# Altium schematic sheet 07_EL_CON.SchDoc
size A2
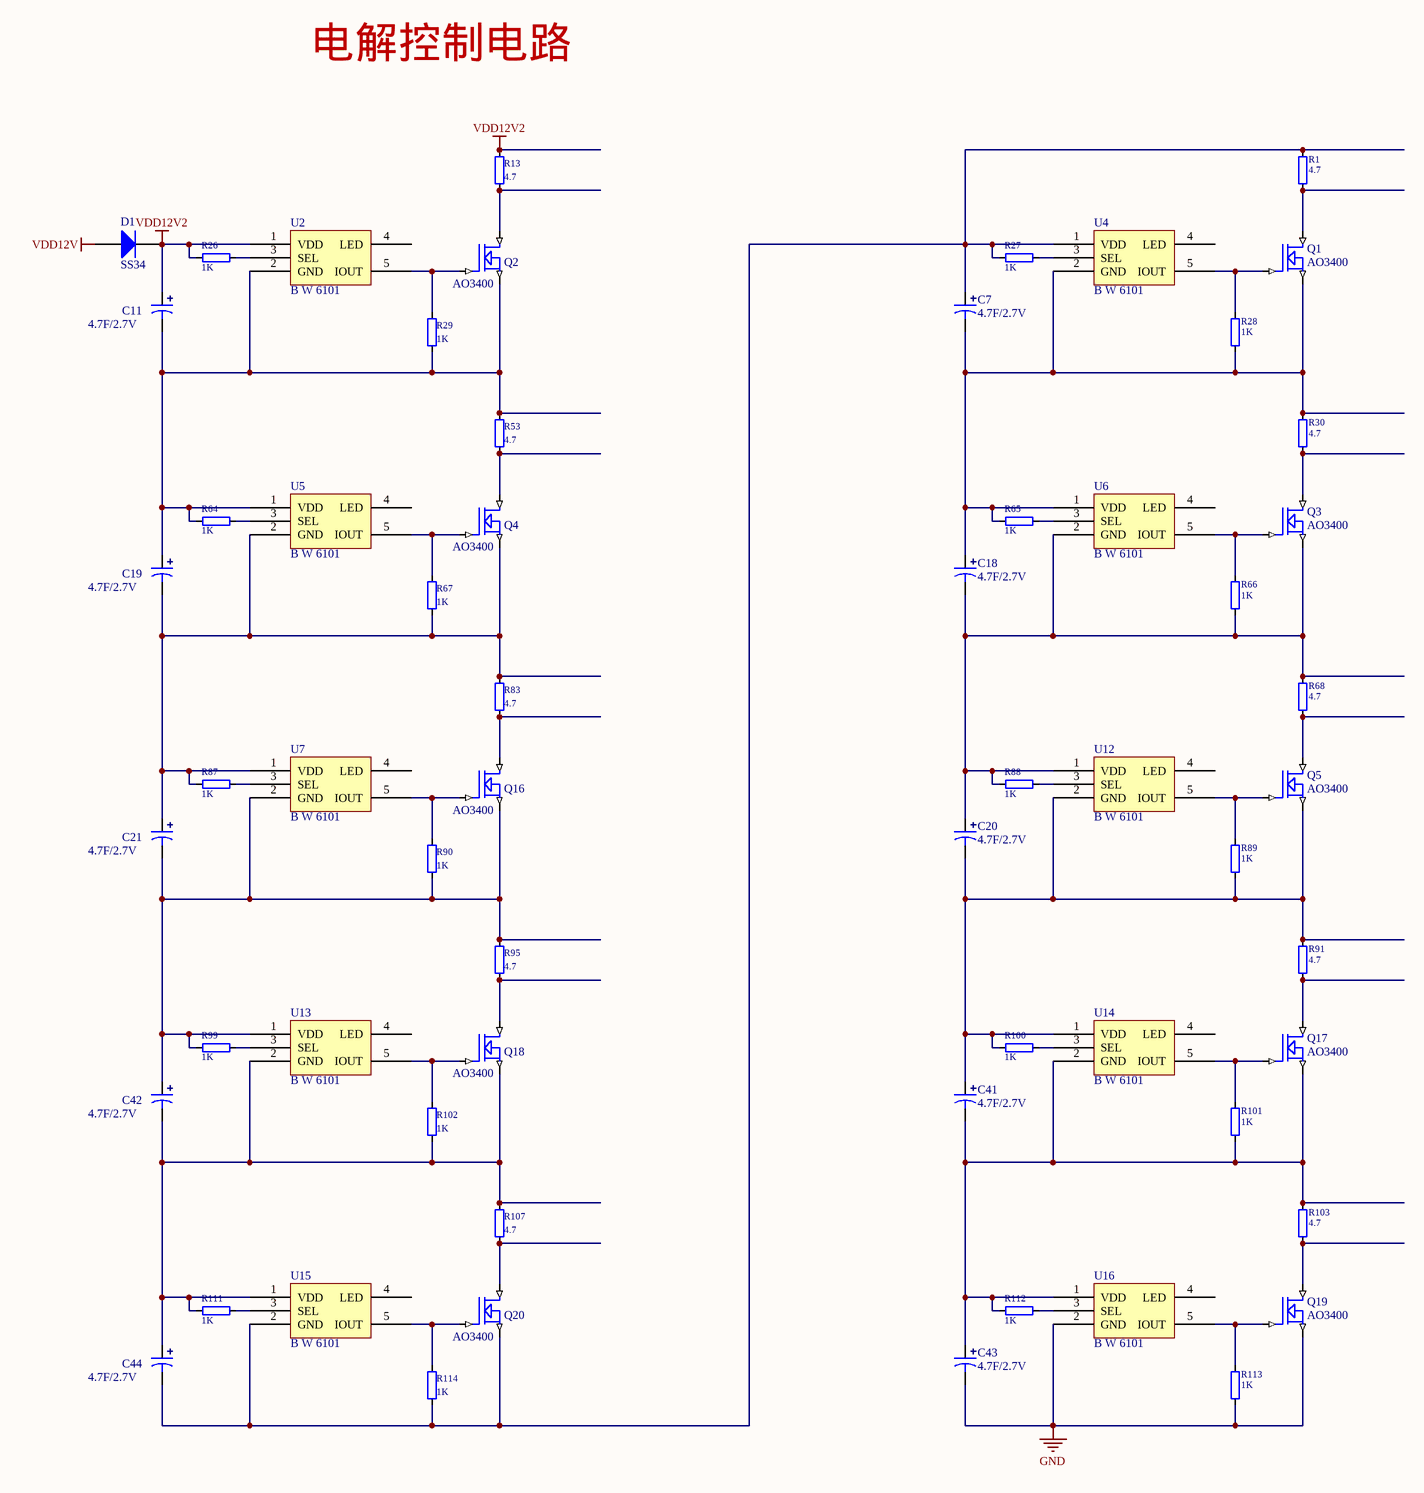
[diagram p0: 07_EL_CON.SchDoc]

## Parts
C7  4.7F/2.7V  [10*16 -5]
C11  4.7F/2.7V  [10*16 -5]
C18  4.7F/2.7V  [10*16 -5]
C19  4.7F/2.7V  [10*16 -5]
C20  4.7F/2.7V  [10*16 -5]
C21  4.7F/2.7V  [10*16 -5]
C41  4.7F/2.7V  [10*16 -5]
C42  4.7F/2.7V  [10*16 -5]
C43  4.7F/2.7V  [10*16 -5]
C44  4.7F/2.7V  [10*16 -5]
D1  SS34  [SMA]
Q1  AO3400  [SOT-23]
Q2  AO3400  [SOT-23]
Q3  AO3400  [SOT-23]
Q4  AO3400  [SOT-23]
Q5  AO3400  [SOT-23]
Q16  AO3400  [SOT-23]
Q17  AO3400  [SOT-23]
Q18  AO3400  [SOT-23]
Q19  AO3400  [SOT-23]
Q20  AO3400  [SOT-23]
R1  4.7  [2010R]
R13  4.7  [2010R]
R26  1K  [0603R]
R27  1K  [0603R]
R28  1K  [0603R]
R29  1K  [0603R]
R30  4.7  [2010R]
R53  4.7  [2010R]
R64  1K  [0603R]
R65  1K  [0603R]
R66  1K  [0603R]
R67  1K  [0603R]
R68  4.7  [2010R]
R83  4.7  [2010R]
R87  1K  [0603R]
R88  1K  [0603R]
R89  1K  [0603R]
R90  1K  [0603R]
R91  4.7  [2010R]
R95  4.7  [2010R]
R99  1K  [0603R]
R100  1K  [0603R]
R101  1K  [0603R]
R102  1K  [0603R]
R103  4.7  [2010R]
R107  4.7  [2010R]
R111  1K  [0603R]
R112  1K  [0603R]
R113  1K  [0603R]
R114  1K  [0603R]
U2  B W 6101  [SOT23-5]
U4  B W 6101  [SOT23-5]
U5  B W 6101  [SOT23-5]
U6  B W 6101  [SOT23-5]
U7  B W 6101  [SOT23-5]
U12  B W 6101  [SOT23-5]
U13  B W 6101  [SOT23-5]
U14  B W 6101  [SOT23-5]
U15  B W 6101  [SOT23-5]
U16  B W 6101  [SOT23-5]

## Nets
GND: C43.2 Q19.2(S) R113.2 U16.2(GND)
VDD12V: D1.1(A)
VDD12V2: C11.1 D1.2(K) R13.1 R26.1 U2.1(VDD)
NetC7_1: C7.1 C44.2 Q20.2(S) R1.1 R27.1 R114.2 U4.1(VDD) U15.2(GND)
NetC7_2: C7.2 C18.1 Q1.2(S) R28.2 R30.1 R65.1 U4.2(GND) U6.1(VDD)
NetC11_2: C11.2 C19.1 Q2.2(S) R29.2 R53.1 R64.1 U2.2(GND) U5.1(VDD)
NetC18_2: C18.2 C20.1 Q3.2(S) R66.2 R68.1 R88.1 U6.2(GND) U12.1(VDD)
NetC19_2: C19.2 C21.1 Q4.2(S) R67.2 R83.1 R87.1 U5.2(GND) U7.1(VDD)
NetC20_2: C20.2 C41.1 Q5.2(S) R89.2 R91.1 R100.1 U12.2(GND) U14.1(VDD)
NetC21_2: C21.2 C42.1 Q16.2(S) R90.2 R95.1 R99.1 U7.2(GND) U13.1(VDD)
NetC41_2: C41.2 C43.1 Q17.2(S) R101.2 R103.1 R112.1 U14.2(GND) U16.1(VDD)
NetC42_2: C42.2 C44.1 Q18.2(S) R102.2 R107.1 R111.1 U13.2(GND) U15.1(VDD)
NetQ1_1: Q1.1(G) R28.1 U4.5(IOUT)
NetQ1_3: Q1.3(D) R1.2
NetQ2_1: Q2.1(G) R29.1 U2.5(IOUT)
NetQ2_3: Q2.3(D) R13.2
NetQ3_1: Q3.1(G) R66.1 U6.5(IOUT)
NetQ3_3: Q3.3(D) R30.2
NetQ4_1: Q4.1(G) R67.1 U5.5(IOUT)
NetQ4_3: Q4.3(D) R53.2
NetQ5_1: Q5.1(G) R89.1 U12.5(IOUT)
NetQ5_3: Q5.3(D) R68.2
NetQ16_1: Q16.1(G) R90.1 U7.5(IOUT)
NetQ16_3: Q16.3(D) R83.2
NetQ17_1: Q17.1(G) R101.1 U14.5(IOUT)
NetQ17_3: Q17.3(D) R91.2
NetQ18_1: Q18.1(G) R102.1 U13.5(IOUT)
NetQ18_3: Q18.3(D) R95.2
NetQ19_1: Q19.1(G) R113.1 U16.5(IOUT)
NetQ19_3: Q19.3(D) R103.2
NetQ20_1: Q20.1(G) R114.1 U15.5(IOUT)
NetQ20_3: Q20.3(D) R107.2
NetR26_2: R26.2 U2.3(SEL)
NetR27_2: R27.2 U4.3(SEL)
NetR64_2: R64.2 U5.3(SEL)
NetR65_2: R65.2 U6.3(SEL)
NetR87_2: R87.2 U7.3(SEL)
NetR88_2: R88.2 U12.3(SEL)
NetR99_2: R99.2 U13.3(SEL)
NetR100_2: R100.2 U14.3(SEL)
NetR111_2: R111.2 U15.3(SEL)
NetR112_2: R112.2 U16.3(SEL)

Not connected (* = marked no-connect by the designer): U2 4(LED); U4 4(LED); U5 4(LED); U6 4(LED); U7 4(LED); U12 4(LED); U13 4(LED); U14 4(LED); U15 4(LED); U16 4(LED)

## Notes on the sheet
- 电解控制电路

## Library data of the parts
C7 C11 C18-C21 C41-C44 = CAP2: 电解电容
D1 = DIODE
Q1-Q5 Q16-Q20 = MOSFET N
R1 R13 R26-R30 R53 R64-R68 R83 R87-R91 R95 R99-R103 R107 R111-R114 = RES